# Altium schematic sheet [05] - LCD-EEPROM-RTC.SchDoc
size A3; DocumentNumber: 5; SheetNumber: 5; SheetTotal: 10
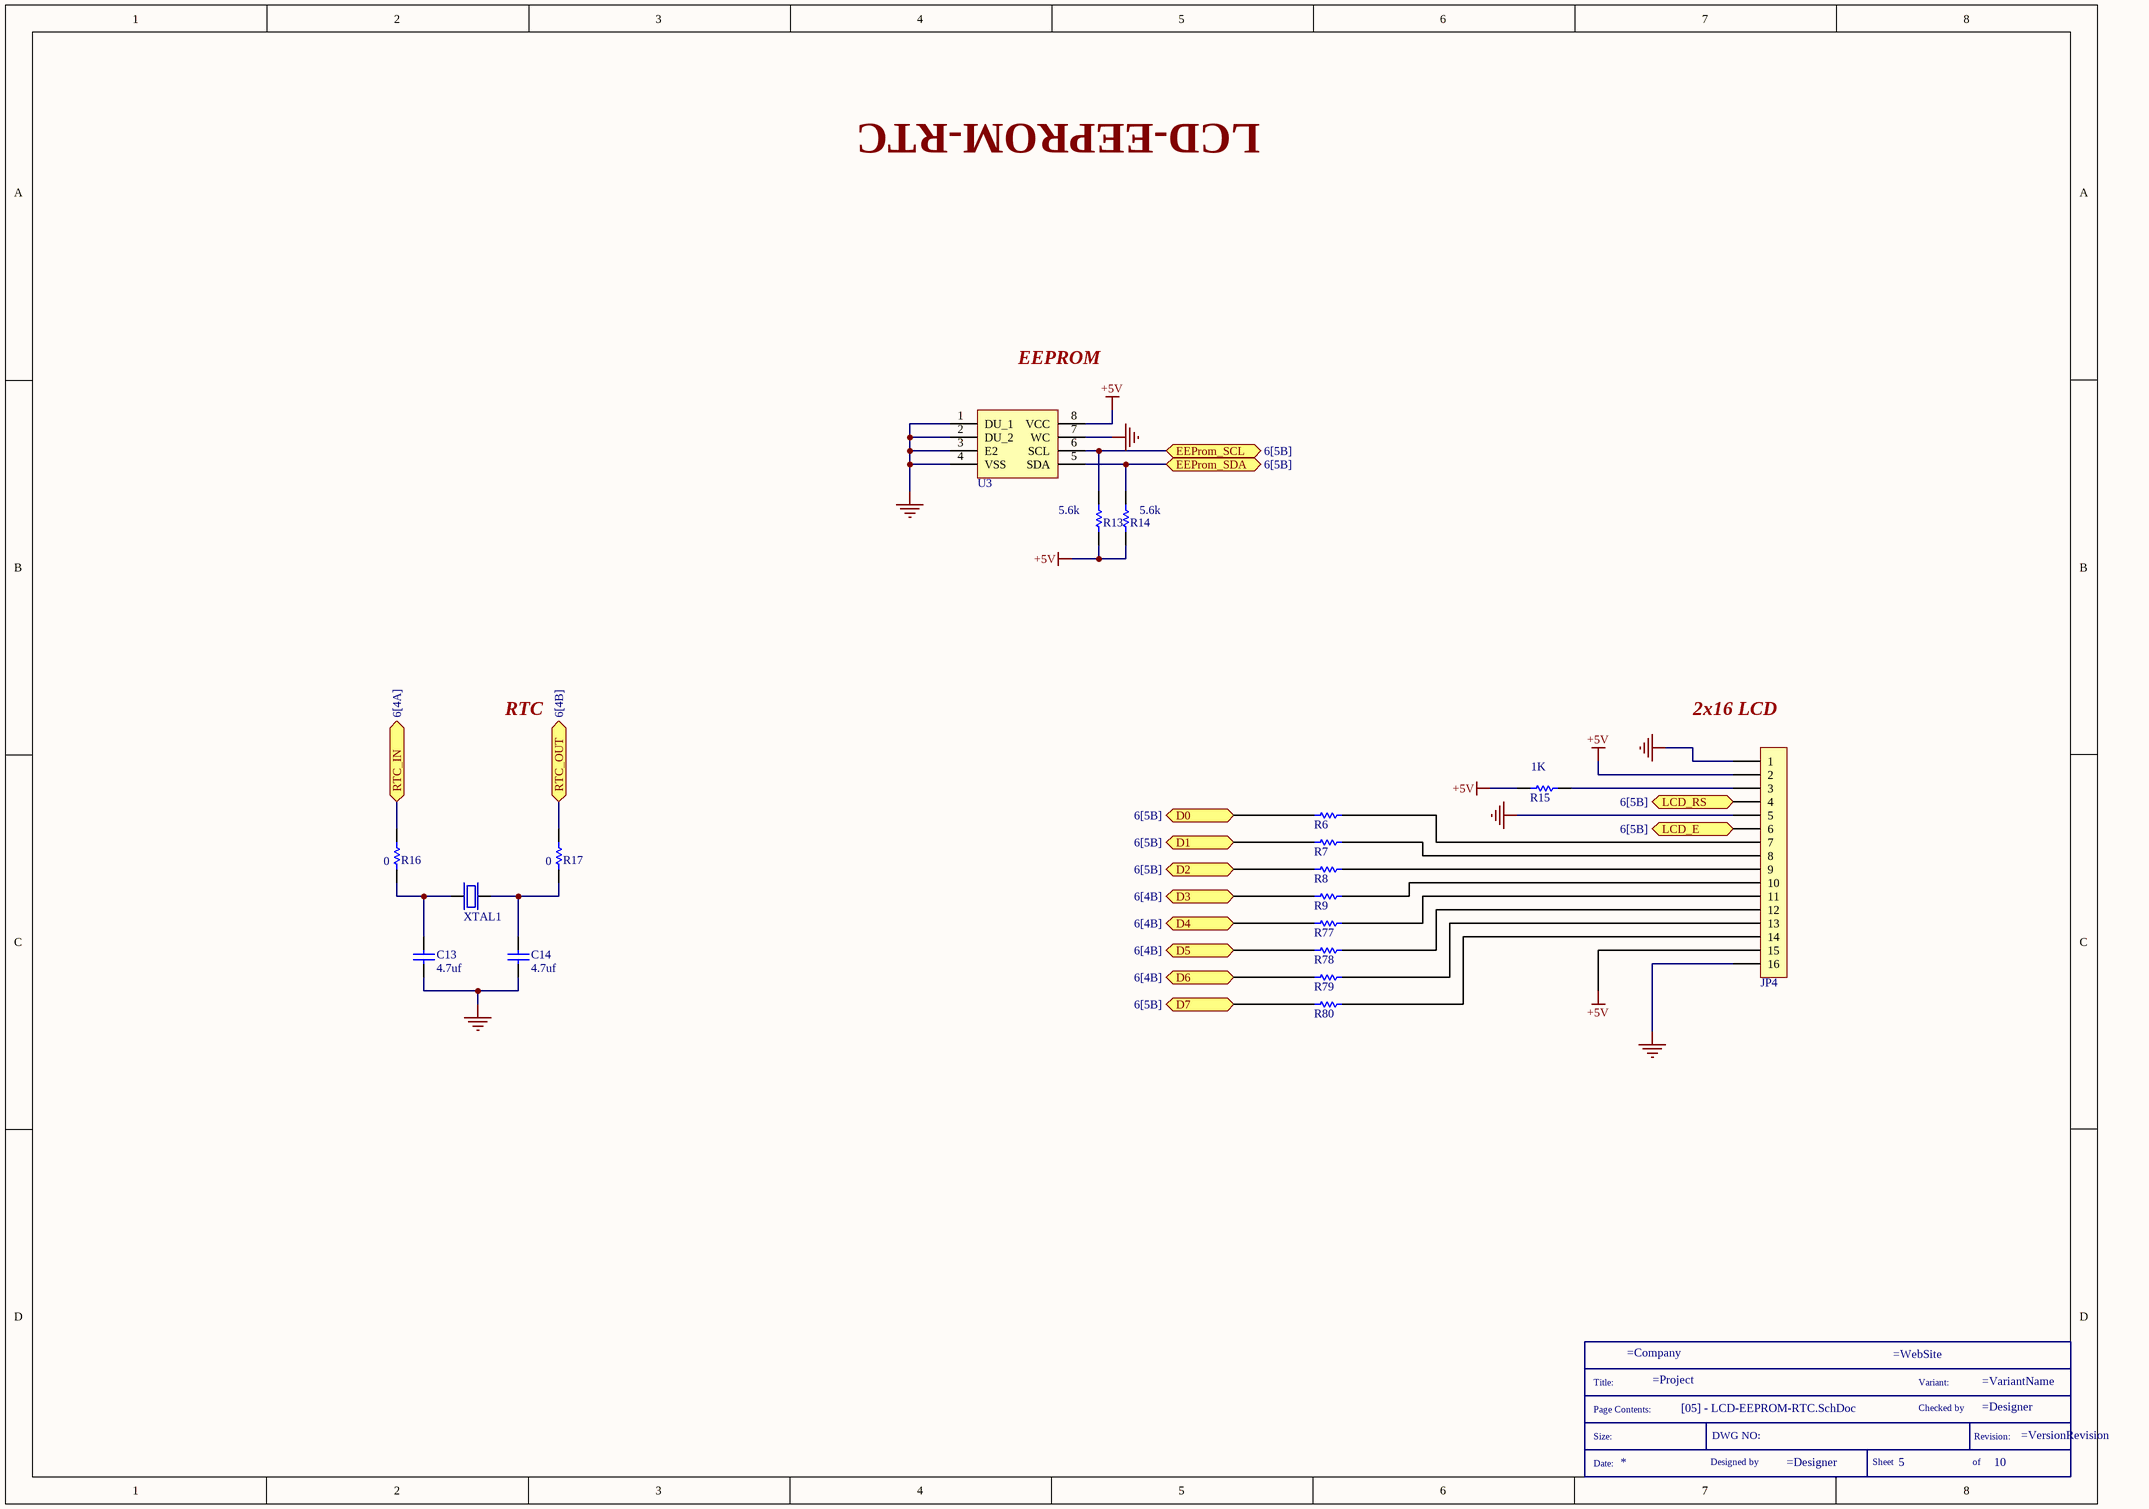
[diagram p0: [05] - LCD-EEPROM-RTC.SchDoc]

## Parts
*  SCH_TITLE  (value not drawn)  (graphical)
C13  4.7uf  [CAP_CER_0603]
C14  4.7uf  [CAP_CER_0603]
JP4  HDR FEMALE 1x16 2.54MM  [HDR_FEMALE_1x16_2.54MM]  (value not drawn)
R6  0 1/8W  [RES_0805]  (value not drawn)
R7  0 1/8W  [RES_0805]  (value not drawn)
R8  0 1/8W  [RES_0805]  (value not drawn)
R9  0 1/8W  [RES_0805]  (value not drawn)
R13  5.6k  [RES_0805]
R14  5.6k  [RES_0805]
R15  1K  [RES_0805]
R16  0  [RES_0805]
R17  0  [RES_0805]
R77  0 1/8W  [RES_0805]  (value not drawn)
R78  0 1/8W  [RES_0805]  (value not drawn)
R79  0 1/8W  [RES_0805]  (value not drawn)
R80  0 1/8W  [RES_0805]  (value not drawn)
U3  2M EEPROM  [SOIC-8]  (value not drawn)
XTAL1  32.768KHZ  [XTAL_2SMD]  (value not drawn)

## Ports
D0 (see 6[5B]), D1 (see 6[5B]), D2 (see 6[5B]), D3 (see 6[4B]), D4 (see 6[4B]), D5 (see 6[4B]), D6 (see 6[4B]), D7 (see 6[5B]), EEProm_SCL (see 6[5B]), EEProm_SDA (see 6[5B]), LCD_E (see 6[5B]), LCD_RS (see 6[5B]), RTC_IN (see 6[4A]), RTC_OUT (see 6[4B])

## Nets
+5V: JP4.2 JP4.15 R13.1 R14.1 R15.1 U3.8(VCC)
GND: C13.1 C14.1 JP4.1 JP4.5 JP4.16 U3.1(DU_1) U3.2(DU_2) U3.3(E2) U3.4(VSS) U3.7(WC)
D0: R6.1 ; port D0
D1: R7.1 ; port D1
D2: R8.1 ; port D2
D3: R9.1 ; port D3
D4: R77.1 ; port D4
D5: R78.1 ; port D5
D6: R79.1 ; port D6
D7: R80.1 ; port D7
EEProm_SCL: R13.2 U3.6(SCL) ; port EEProm_SCL
EEProm_SDA: R14.2 U3.5(SDA) ; port EEProm_SDA
LCD_E: JP4.6 ; port LCD_E
LCD_RS: JP4.4 ; port LCD_RS
RTC_IN: R16.2 ; port RTC_IN
RTC_OUT: R17.2 ; port RTC_OUT
NetC13_2: C13.2 R16.1 XTAL1.1
NetC14_2: C14.2 R17.1 XTAL1.2
NetJP4_3: JP4.3 R15.2
NetJP4_7: JP4.7 R6.2
NetJP4_8: JP4.8 R7.2
NetJP4_9: JP4.9 R8.2
NetJP4_10: JP4.10 R9.2
NetJP4_11: JP4.11 R77.2
NetJP4_12: JP4.12 R78.2
NetJP4_13: JP4.13 R79.2
NetJP4_14: JP4.14 R80.2

## Notes on the sheet
- LCD-EEPROM-RTC
- EEPROM
- RTC
- 2x16 LCD
- (in symbol SCH_TITLE) Title:; Variant:; Page Contents:; Checked by; Size:; DWG NO:; Revision:; Date:; Designed by; Sheet; of

## Library data of the parts
* = SCH_TITLE: Schematic information
C13 C14 = CGA3E2C0G1H4R7C080AA: CAP CER 4.7PF 50V C0G 0603; Manufacturer 1: TDK Corporation; Category: Ceramic Capacitors; Manufacturer Part Number 1: CGA3E2C0G1H4R7C080AA; Case/Package: 0603 (1608 Metric); Quantity: 1; Supplier 1: Digikey; Supplier Part Number 1: 445-5621-1-ND; Supplier Stock 1: 68332; Supplier Unit Price 1: 0.19; Supplier Currency 1: $
JP4 = PPTC161LFBN-RC: Manufacturer 1: Sullins Connector Solutions; Category: Rectangular Connectors - Headers, Receptacles, Female Sockets; Manufacturer Part Number 1: PPTC161LFBN-RC; Case/Package: 16Pos_2.5mm_Pitch; Quantity: 1; Supplier 1: Digikey; Supplier Part Number 1: S7014-ND; Supplier Order Qty 1: 1; Supplier Stock 1: 9562; Supplier Unit Price  1: 0,98; Supplier Currency 1: $
R6-R9 R16 R17 R77-R80 = CRCW08050000Z0EA": RES SMD 0 OHM JUMPER 1/8W 0805; Manufacturer 1: Vishay Dale; Case/Package: 0805 (2012 Metric); Manufacturer Part Number 1: CRCW08050000Z0EA; Category: Chip Resistor - Surface Mount; Quantity: 1; Supplier 1: Digikey; Supplier Part Number 1: 541-0.0ACT-ND; Supplier Stock 1: 746599; Supplier Unit Price 1: 0.1; Supplier Currency 1: $
R13 R14 = ERJ-6ENF5601V: RES SMD 5.6K OHM 1% 1/8W 0805; Manufacturer 1: Panasonic Electronic Components; Category: Chip Resistor - Surface Mount; Manufacturer Part Number 1: ERJ-6ENF5601V; Case/Package: 0805 (2012 Metric); Quantity: 1; Supplier 1: Digikey; Supplier Part Number 1: P5.60KCCT-ND; Supplier Order Qty 1: 1; Supplier Stock 1: 71341; Supplier Unit Price 1: 0,1; Supplier Currency 1: $
R15 = ERJ-6ENF1001V: RES SMD 1K OHM; Manufacturer 1: Panasonic Electronic Components; Category: Chip Resistor - Surface Mount; Manufacturer Part Number 1: ERJ-6ENF1001V; Case/Package: 0805 (2012 Metric); Quantity: 1; Supplier 1: Digikey; Supplier Part Number 1: P1.00KCCT-ND; Supplier Order Qty 1: 1; Supplier Stock 1: 1361018; Supplier Unit Price 1: 0,1; Supplier Currency 1: $
U3 = M24M02-DWMN3TP/K: IC EEPROM 2M I2C 1MHZ 8SO; Manufacturer 1: STMicroelectronics; Category: Memory; Manufacturer Part Number 1: M24M02-DWMN3TP/K; Case/Package: 8-SOIC (0.154", 3.90mm Width); Quantity: 1; Supplier 1: Digikey; Supplier Part Number 1: 497-16238-1-ND; Supplier Order Qty 1: 1; Supplier Stock 1: 6027; Supplier Unit Price 1: 3,28; Supplier Currency 1: $
XTAL1 = ECS-.327-6-34QCS-TR: CRYSTAL 32.768KHZ; Manufacturer 1: ECS Inc.; Category: Crystals; Manufacturer Part Number 1: ECS-.327-6-34QCS-TR; Case/Package: 2-SMD, No Lead; Quantity: 1; Supplier 1: Digikey; Supplier Part Number 1: XC2162CT-ND; Supplier Order Qty 1: 1; Supplier Stock 1: 1833; Supplier Unit Price 1: 0,83; Supplier Currency 1: $